# Altium schematic sheet Page05 LPDDR4.SchDoc
size 513 x 386 mm
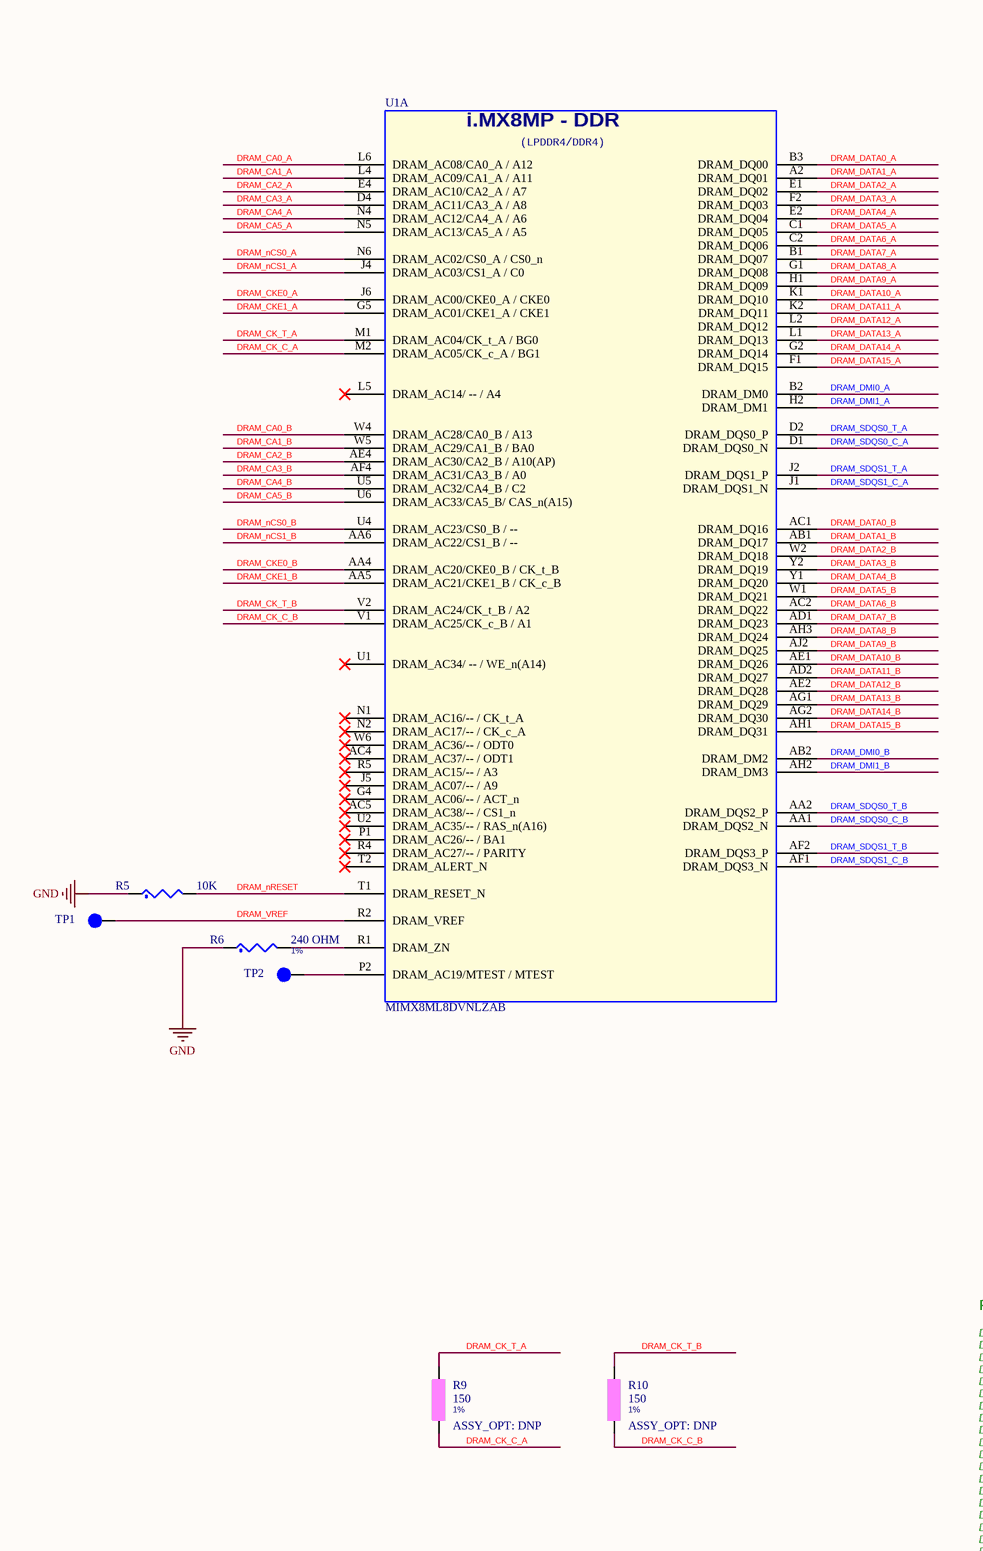
[diagram p0: Page05 LPDDR4.SchDoc, left]
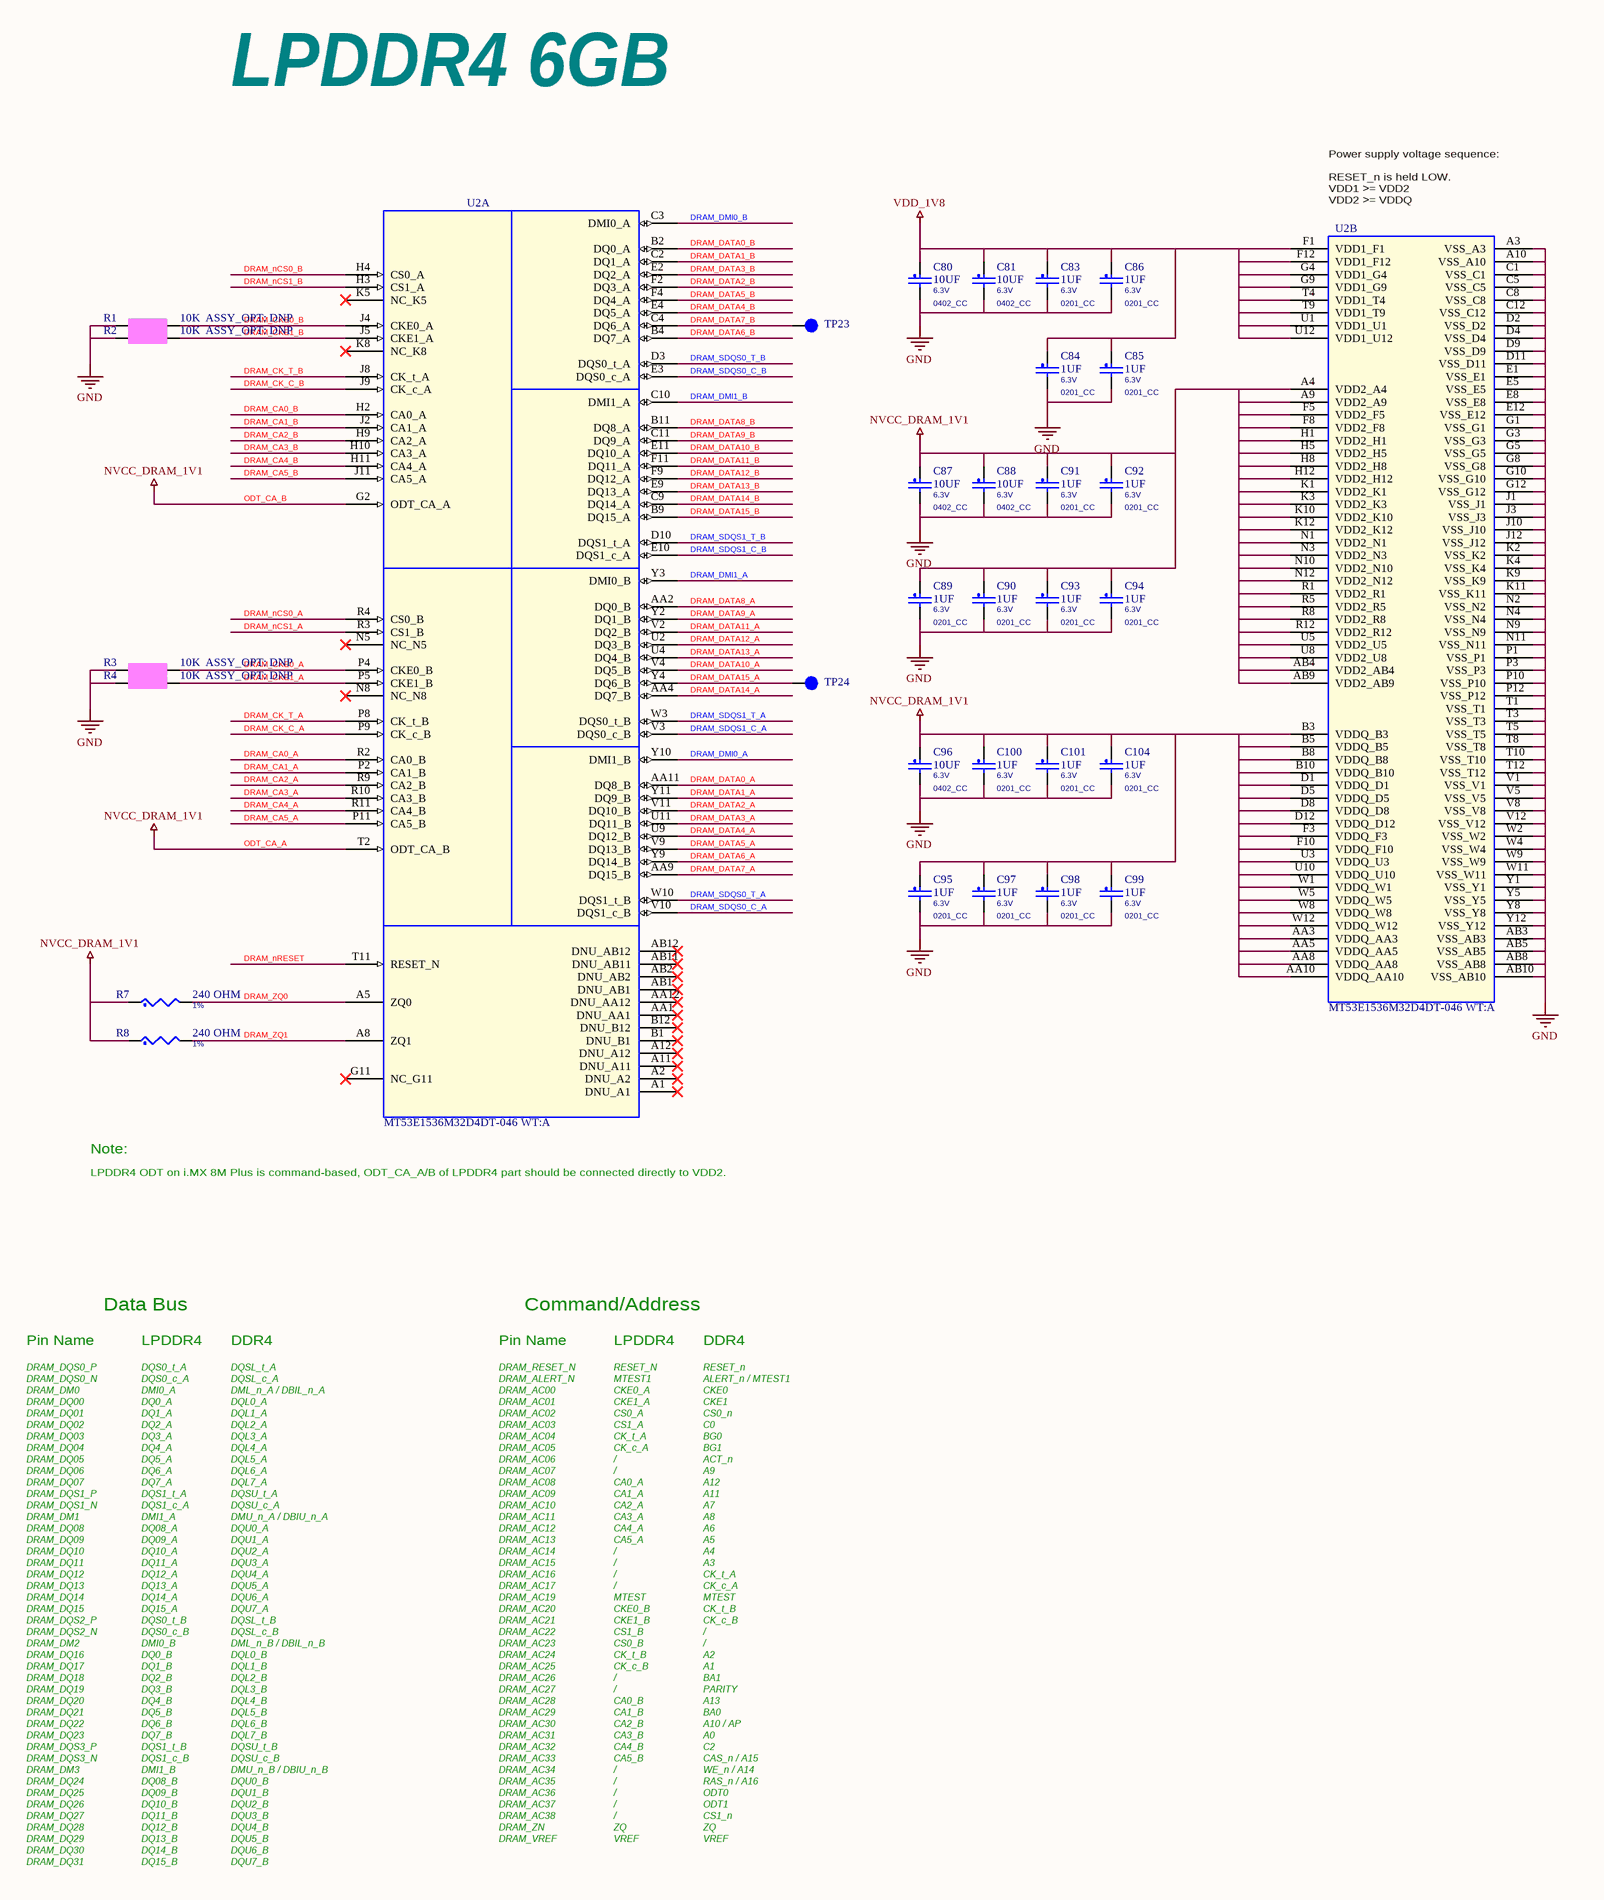
[diagram p1: Page05 LPDDR4.SchDoc, right]

## Parts
C80  10UF  VOLTAGE: 6.3V  [0402_CC]
C81  10UF  VOLTAGE: 6.3V  [0402_CC]
C83  1UF  VOLTAGE: 6.3V  [0201_CC]
C84  1UF  VOLTAGE: 6.3V  [0201_CC]
C85  1UF  VOLTAGE: 6.3V  [0201_CC]
C86  1UF  VOLTAGE: 6.3V  [0201_CC]
C87  10UF  VOLTAGE: 6.3V  [0402_CC]
C88  10UF  VOLTAGE: 6.3V  [0402_CC]
C89  1UF  VOLTAGE: 6.3V  [0201_CC]
C90  1UF  VOLTAGE: 6.3V  [0201_CC]
C91  1UF  VOLTAGE: 6.3V  [0201_CC]
C92  1UF  VOLTAGE: 6.3V  [0201_CC]
C93  1UF  VOLTAGE: 6.3V  [0201_CC]
C94  1UF  VOLTAGE: 6.3V  [0201_CC]
C95  1UF  VOLTAGE: 6.3V  [0201_CC]
C96  10UF  VOLTAGE: 6.3V  [0402_CC]
C97  1UF  VOLTAGE: 6.3V  [0201_CC]
C98  1UF  VOLTAGE: 6.3V  [0201_CC]
C99  1UF  VOLTAGE: 6.3V  [0201_CC]
C100  1UF  VOLTAGE: 6.3V  [0201_CC]
C101  1UF  VOLTAGE: 6.3V  [0201_CC]
C104  1UF  VOLTAGE: 6.3V  [0201_CC]
R1  10K  ASSY_OPT: DNP  [0402_CC]
R2  10K  ASSY_OPT: DNP  [0402_CC]
R3  10K  ASSY_OPT: DNP  [0402_CC]
R4  10K  ASSY_OPT: DNP  [0402_CC]
R5  10K  [0201_CC]
R6  240 OHM  Tolerance: 1%  [0201_CC]
R7  240 OHM  Tolerance: 1%  [0201_CC]
R8  240 OHM  Tolerance: 1%  [0201_CC]
R9  150  ASSY_OPT: DNP  Tolerance: 1%  [0402_CC]
R10  150  ASSY_OPT: DNP  Tolerance: 1%  [0402_CC]
TP1  TPAD_015  [TPAD_015]  (value not drawn)
TP2  TPAD_015  [TPAD_015]  (value not drawn)
TP23  tpad_020  [tpad_020]  (value not drawn)
TP24  tpad_020  [tpad_020]  (value not drawn)
U1  MIMX8ML8DVNLZAB  [BGA_M865S_0P5_15X15-BMS]  (part A of 15)
U2  MT53E1536M32D4DT-046 WT:A  [bga200_0p65x0p8_10p1x14p6]  (parts A,B of 2)

## Nets
GND: C80.2 C81.2 C83.2 C84.2 C85.2 C86.2 C87.2 C88.2 C89.2 C90.2 C91.2 C92.2 C93.2 C94.2 C95.2 C96.2 C97.2 C98.2 C99.2 C100.2 C101.2 C104.2 R1.1 R2.1 R3.1 R4.1 R5.1 R6.1 U2.A3(VSS_A3) U2.A10(VSS_A10) U2.AB3(VSS_AB3) U2.AB5(VSS_AB5) U2.AB8(VSS_AB8) U2.AB10(VSS_AB10) U2.C1(VSS_C1) U2.C5(VSS_C5) U2.C8(VSS_C8) U2.C12(VSS_C12) U2.D2(VSS_D2) U2.D4(VSS_D4) U2.D9(VSS_D9) U2.D11(VSS_D11) U2.E1(VSS_E1) U2.E5(VSS_E5) U2.E8(VSS_E8) U2.E12(VSS_E12) U2.G1(VSS_G1) U2.G3(VSS_G3) U2.G5(VSS_G5) U2.G8(VSS_G8) U2.G10(VSS_G10) U2.G12(VSS_G12) U2.J1(VSS_J1) U2.J3(VSS_J3) U2.J10(VSS_J10) U2.J12(VSS_J12) U2.K2(VSS_K2) U2.K4(VSS_K4) U2.K9(VSS_K9) U2.K11(VSS_K11) U2.N2(VSS_N2) U2.N4(VSS_N4) U2.N9(VSS_N9) U2.N11(VSS_N11) U2.P1(VSS_P1) U2.P3(VSS_P3) U2.P10(VSS_P10) U2.P12(VSS_P12) U2.T1(VSS_T1) U2.T3(VSS_T3) U2.T5(VSS_T5) U2.T8(VSS_T8) U2.T10(VSS_T10) U2.T12(VSS_T12) U2.V1(VSS_V1) U2.V5(VSS_V5) U2.V8(VSS_V8) U2.V12(VSS_V12) U2.W2(VSS_W2) U2.W4(VSS_W4) U2.W9(VSS_W9) U2.W11(VSS_W11) U2.Y1(VSS_Y1) U2.Y5(VSS_Y5) U2.Y8(VSS_Y8) U2.Y12(VSS_Y12)
ODT_CA_A: C87.1 C88.1 C89.1 C90.1 C91.1 C92.1 C93.1 C94.1 C95.1 C96.1 C97.1 C98.1 C99.1 C100.1 C101.1 C104.1 R7.1 R8.1 U2.A4(VDD2_A4) U2.A9(VDD2_A9) U2.AA3(VDDQ_AA3) U2.AA5(VDDQ_AA5) U2.AA8(VDDQ_AA8) U2.AA10(VDDQ_AA10) U2.AB4(VDD2_AB4) U2.AB9(VDD2_AB9) U2.B3(VDDQ_B3) U2.B5(VDDQ_B5) U2.B8(VDDQ_B8) U2.B10(VDDQ_B10) U2.D1(VDDQ_D1) U2.D5(VDDQ_D5) U2.D8(VDDQ_D8) U2.D12(VDDQ_D12) U2.F3(VDDQ_F3) U2.F5(VDD2_F5) U2.F8(VDD2_F8) U2.F10(VDDQ_F10) U2.G2(ODT_CA_A) U2.H1(VDD2_H1) U2.H5(VDD2_H5) U2.H8(VDD2_H8) U2.H12(VDD2_H12) U2.K1(VDD2_K1) U2.K3(VDD2_K3) U2.K10(VDD2_K10) U2.K12(VDD2_K12) U2.N1(VDD2_N1) U2.N3(VDD2_N3) U2.N10(VDD2_N10) U2.N12(VDD2_N12) U2.R1(VDD2_R1) U2.R5(VDD2_R5) U2.R8(VDD2_R8) U2.R12(VDD2_R12) U2.T2(ODT_CA_B) U2.U3(VDDQ_U3) U2.U5(VDD2_U5) U2.U8(VDD2_U8) U2.U10(VDDQ_U10) U2.W1(VDDQ_W1) U2.W5(VDDQ_W5) U2.W8(VDDQ_W8) U2.W12(VDDQ_W12)  [also labelled NVCC_DRAM_1V1, ODT_CA_B]
VDD_1V8: C80.1 C81.1 C83.1 C84.1 C85.1 C86.1 U2.F1(VDD1_F1) U2.F12(VDD1_F12) U2.G4(VDD1_G4) U2.G9(VDD1_G9) U2.T4(VDD1_T4) U2.T9(VDD1_T9) U2.U1(VDD1_U1) U2.U12(VDD1_U12)
DRAM_CA0_A: U1.L6(DRAM_AC08/CA0_A_/_A12) U2.R2(CA0_B)
DRAM_CA0_B: U1.W4(DRAM_AC28/CA0_B_/_A13) U2.H2(CA0_A)
DRAM_CA1_A: U1.L4(DRAM_AC09/CA1_A_/_A11) U2.P2(CA1_B)
DRAM_CA1_B: U1.W5(DRAM_AC29/CA1_B_/_BA0) U2.J2(CA1_A)
DRAM_CA2_A: U1.E4(DRAM_AC10/CA2_A_/_A7) U2.R9(CA2_B)
DRAM_CA2_B: U1.AE4(DRAM_AC30/CA2_B_/_A10(AP)) U2.H9(CA2_A)
DRAM_CA3_A: U1.D4(DRAM_AC11/CA3_A_/_A8) U2.R10(CA3_B)
DRAM_CA3_B: U1.AF4(DRAM_AC31/CA3_B_/_A0) U2.H10(CA3_A)
DRAM_CA4_A: U1.N4(DRAM_AC12/CA4_A_/_A6) U2.R11(CA4_B)
DRAM_CA4_B: U1.U5(DRAM_AC32/CA4_B_/_C2) U2.H11(CA4_A)
DRAM_CA5_A: U1.N5(DRAM_AC13/CA5_A_/_A5) U2.P11(CA5_B)
DRAM_CA5_B: U1.U6(DRAM_AC33/CA5_B/_CAS_n(A15)) U2.J11(CA5_A)
DRAM_CK_C_A: R9.2 U1.M2(DRAM_AC05/CK_c_A_/_BG1) U2.P9(CK_c_B)
DRAM_CK_C_B: R10.2 U1.V1(DRAM_AC25/CK_c_B_/_A1) U2.J9(CK_c_A)
DRAM_CK_T_A: R9.1 U1.M1(DRAM_AC04/CK_t_A_/_BG0) U2.P8(CK_t_B)
DRAM_CK_T_B: R10.1 U1.V2(DRAM_AC24/CK_t_B_/_A2) U2.J8(CK_t_A)
DRAM_CKE0_A: R3.2 U1.J6(DRAM_AC00/CKE0_A_/_CKE0) U2.P4(CKE0_B)
DRAM_CKE0_B: R1.2 U1.AA4(DRAM_AC20/CKE0_B_/_CK_t_B) U2.J4(CKE0_A)
DRAM_CKE1_A: R4.2 U1.G5(DRAM_AC01/CKE1_A_/_CKE1) U2.P5(CKE1_B)
DRAM_CKE1_B: R2.2 U1.AA5(DRAM_AC21/CKE1_B_/_CK_c_B) U2.J5(CKE1_A)
DRAM_DATA0_A: U1.B3(DRAM_DQ00) U2.AA11(DQ8_B)
DRAM_DATA0_B: U1.AC1(DRAM_DQ16) U2.B2(DQ0_A)
DRAM_DATA1_A: U1.A2(DRAM_DQ01) U2.Y11(DQ9_B)
DRAM_DATA1_B: U1.AB1(DRAM_DQ17) U2.C2(DQ1_A)
DRAM_DATA2_A: U1.E1(DRAM_DQ02) U2.V11(DQ10_B)
DRAM_DATA2_B: U1.W2(DRAM_DQ18) U2.F2(DQ3_A)
DRAM_DATA3_A: U1.F2(DRAM_DQ03) U2.U11(DQ11_B)
DRAM_DATA3_B: U1.Y2(DRAM_DQ19) U2.E2(DQ2_A)
DRAM_DATA4_A: U1.E2(DRAM_DQ04) U2.U9(DQ12_B)
DRAM_DATA4_B: U1.Y1(DRAM_DQ20) U2.E4(DQ5_A)
DRAM_DATA5_A: U1.C1(DRAM_DQ05) U2.V9(DQ13_B)
DRAM_DATA5_B: U1.W1(DRAM_DQ21) U2.F4(DQ4_A)
DRAM_DATA6_A: U1.C2(DRAM_DQ06) U2.Y9(DQ14_B)
DRAM_DATA6_B: U1.AC2(DRAM_DQ22) U2.B4(DQ7_A)
DRAM_DATA7_A: U1.B1(DRAM_DQ07) U2.AA9(DQ15_B)
DRAM_DATA7_B: TP23.1(Pin1) U1.AD1(DRAM_DQ23) U2.C4(DQ6_A)
DRAM_DATA8_A: U1.G1(DRAM_DQ08) U2.AA2(DQ0_B)
DRAM_DATA8_B: U1.AH3(DRAM_DQ24) U2.B11(DQ8_A)
DRAM_DATA9_A: U1.H1(DRAM_DQ09) U2.Y2(DQ1_B)
DRAM_DATA9_B: U1.AJ2(DRAM_DQ25) U2.C11(DQ9_A)
DRAM_DATA10_A: U1.K1(DRAM_DQ10) U2.V4(DQ5_B)
DRAM_DATA10_B: U1.AE1(DRAM_DQ26) U2.E11(DQ10_A)
DRAM_DATA11_A: U1.K2(DRAM_DQ11) U2.V2(DQ2_B)
DRAM_DATA11_B: U1.AD2(DRAM_DQ27) U2.F11(DQ11_A)
DRAM_DATA12_A: U1.L2(DRAM_DQ12) U2.U2(DQ3_B)
DRAM_DATA12_B: U1.AE2(DRAM_DQ28) U2.F9(DQ12_A)
DRAM_DATA13_A: U1.L1(DRAM_DQ13) U2.U4(DQ4_B)
DRAM_DATA13_B: U1.AG1(DRAM_DQ29) U2.E9(DQ13_A)
DRAM_DATA14_A: U1.G2(DRAM_DQ14) U2.AA4(DQ7_B)
DRAM_DATA14_B: U1.AG2(DRAM_DQ30) U2.C9(DQ14_A)
DRAM_DATA15_A: TP24.1(Pin1) U1.F1(DRAM_DQ15) U2.Y4(DQ6_B)
DRAM_DATA15_B: U1.AH1(DRAM_DQ31) U2.B9(DQ15_A)
DRAM_DMI0_A: U1.B2(DRAM_DM0) U2.Y10(DMI1_B)
DRAM_DMI0_B: U1.AB2(DRAM_DM2) U2.C3(DMI0_A)
DRAM_DMI1_A: U1.H2(DRAM_DM1) U2.Y3(DMI0_B)
DRAM_DMI1_B: U1.AH2(DRAM_DM3) U2.C10(DMI1_A)
DRAM_nCS0_A: U1.N6(DRAM_AC02/CS0_A_/_CS0_n) U2.R4(CS0_B)
DRAM_nCS0_B: U1.U4(DRAM_AC23/CS0_B_/_--) U2.H4(CS0_A)
DRAM_nCS1_A: U1.J4(DRAM_AC03/CS1_A_/_C0) U2.R3(CS1_B)
DRAM_nCS1_B: U1.AA6(DRAM_AC22/CS1_B_/_--) U2.H3(CS1_A)
DRAM_nRESET: R5.2 U1.T1(DRAM_RESET_N) U2.T11(RESET_N)
DRAM_SDQS0_C_A: U1.D1(DRAM_DQS0_N) U2.V10(DQS1_c_B)
DRAM_SDQS0_C_B: U1.AA1(DRAM_DQS2_N) U2.E3(DQS0_c_A)
DRAM_SDQS0_T_A: U1.D2(DRAM_DQS0_P) U2.W10(DQS1_t_B)
DRAM_SDQS0_T_B: U1.AA2(DRAM_DQS2_P) U2.D3(DQS0_t_A)
DRAM_SDQS1_C_A: U1.J1(DRAM_DQS1_N) U2.V3(DQS0_c_B)
DRAM_SDQS1_C_B: U1.AF1(DRAM_DQS3_N) U2.E10(DQS1_c_A)
DRAM_SDQS1_T_A: U1.J2(DRAM_DQS1_P) U2.W3(DQS0_t_B)
DRAM_SDQS1_T_B: U1.AF2(DRAM_DQS3_P) U2.D10(DQS1_t_A)
DRAM_VREF: TP1.1(Pin1) U1.R2(DRAM_VREF)
DRAM_ZQ0: R7.2 U2.A5(ZQ0)
DRAM_ZQ1: R8.2 U2.A8(ZQ1)
NetR6_2: R6.2 U1.R1(DRAM_ZN)
NetTP2_1: TP2.1(Pin1) U1.P2(DRAM_AC19/MTEST_/_MTEST)

Not connected (* = marked no-connect by the designer): U1 AC4(DRAM_AC37/--_/_ODT1)* AC5(DRAM_AC38/--_/_CS1_n)* G4(DRAM_AC06/--_/_ACT_n)* J5(DRAM_AC07/--_/_A9)* L5(DRAM_AC14/_--_/_A4)* N1(DRAM_AC16/--_/_CK_t_A)* N2(DRAM_AC17/--_/_CK_c_A)* P1(DRAM_AC26/--_/_BA1)* R4(DRAM_AC27/--_/_PARITY)* R5(DRAM_AC15/--_/_A3)* T2(DRAM_ALERT_N)* U1(DRAM_AC34/_--_/_WE_n(A14))* U2(DRAM_AC35/--_/_RAS_n(A16))* W6(DRAM_AC36/--_/_ODT0)*; U2 A1(DNU_A1)* A2(DNU_A2)* A11(DNU_A11)* A12(DNU_A12)* AA1(DNU_AA1)* AA12(DNU_AA12)* AB1(DNU_AB1)* AB2(DNU_AB2)* AB11(DNU_AB11)* AB12(DNU_AB12)* B1(DNU_B1)* B12(DNU_B12)* G11(NC_G11)* K5(NC_K5)* K8(NC_K8)* N5(NC_N5)* N8(NC_N8)*

## Notes on the sheet
- LPDDR4 6GB
- (near U2) Power supply voltage sequence:
  RESET_n is held LOW.
  VDD1 >= VDD2
  VDD2 >= VDDQ
- Note:
- LPDDR4 ODT on i.MX 8M Plus is command-based, ODT_CA_A/B of LPDDR4 part should be connected directly to VDD2.
- Pin Name
- DRAM_DQS0_P
  DRAM_DQS0_N
  DRAM_DM0
  DRAM_DQ00
  DRAM_DQ01
  DRAM_DQ02
  DRAM_DQ03
  DRAM_DQ04
  DRAM_DQ05
  DRAM_DQ06
  DRAM_DQ07
  DRAM_DQS1_P
  DRAM_DQS1_N
  DRAM_DM1
  DRAM_DQ08
  DRAM_DQ09
  DRAM_DQ10
  DRAM_DQ11
  DRAM_DQ12
  DRAM_DQ13
  DRAM_DQ14
  DRAM_DQ15
  DRAM_DQS2_P
  DRAM_DQS2_N
  DRAM_DM2
  DRAM_DQ16
  DRAM_DQ17
  DRAM_DQ18
  DRAM_DQ19
  DRAM_DQ20
  DRAM_DQ21
  DRAM_DQ22
  DRAM_DQ23
  DRAM_DQS3_P
  DRAM_DQS3_N
  DRAM_DM3
  DRAM_DQ24
  DRAM_DQ25
  DRAM_DQ26
  DRAM_DQ27
  DRAM_DQ28
  DRAM_DQ29
  DRAM_DQ30
  DRAM_DQ31
- Data Bus
- DQS0_t_A
  DQS0_c_A
  DMI0_A
  DQ0_A
  DQ1_A
  DQ2_A
  DQ3_A
  DQ4_A
  DQ5_A
  DQ6_A
  DQ7_A
  DQS1_t_A
  DQS1_c_A
  DMI1_A
  DQ08_A
  DQ09_A
  DQ10_A
  DQ11_A
  DQ12_A
  DQ13_A
  DQ14_A
  DQ15_A
  DQS0_t_B
  DQS0_c_B
  DMI0_B
  DQ0_B
  DQ1_B
  DQ2_B
  DQ3_B
  DQ4_B
  DQ5_B
  DQ6_B
  DQ7_B
  DQS1_t_B
  DQS1_c_B
  DMI1_B
  DQ08_B
  DQ09_B
  DQ10_B
  DQ11_B
  DQ12_B
  DQ13_B
  DQ14_B
  DQ15_B
- LPDDR4
- DQSL_t_A
  DQSL_c_A
  DML_n_A / DBIL_n_A
  DQL0_A
  DQL1_A
  DQL2_A
  DQL3_A
  DQL4_A
  DQL5_A
  DQL6_A
  DQL7_A
  DQSU_t_A
  DQSU_c_A
  DMU_n_A / DBIU_n_A
  DQU0_A
  DQU1_A
  DQU2_A
  DQU3_A
  DQU4_A
  DQU5_A
  DQU6_A
  DQU7_A
  DQSL_t_B
  DQSL_c_B
  DML_n_B / DBIL_n_B
  DQL0_B
  DQL1_B
  DQL2_B
  DQL3_B
  DQL4_B
  DQL5_B
  DQL6_B
  DQL7_B
  DQSU_t_B
  DQSU_c_B
  DMU_n_B / DBIU_n_B
  DQU0_B
  DQU1_B
  DQU2_B
  DQU3_B
  DQU4_B
  DQU5_B
  DQU6_B
  DQU7_B
- DDR4
- DRAM_RESET_N
  DRAM_ALERT_N
  DRAM_AC00
  DRAM_AC01
  DRAM_AC02
  DRAM_AC03
  DRAM_AC04
  DRAM_AC05
  DRAM_AC06
  DRAM_AC07
  DRAM_AC08
  DRAM_AC09
  DRAM_AC10
  DRAM_AC11
  DRAM_AC12
  DRAM_AC13
  DRAM_AC14
  DRAM_AC15
  DRAM_AC16
  DRAM_AC17
  DRAM_AC19
  DRAM_AC20
  DRAM_AC21
  DRAM_AC22
  DRAM_AC23
  DRAM_AC24
  DRAM_AC25
  DRAM_AC26
  DRAM_AC27
  DRAM_AC28
  DRAM_AC29
  DRAM_AC30
  DRAM_AC31
  DRAM_AC32
  DRAM_AC33
  DRAM_AC34
  DRAM_AC35
  DRAM_AC36
  DRAM_AC37
  DRAM_AC38
  DRAM_ZN
  DRAM_VREF
- Command/Address
- RESET_N
  MTEST1
  CKE0_A
  CKE1_A
  CS0_A
  CS1_A
  CK_t_A
  CK_c_A
  /
  /
  CA0_A
  CA1_A
  CA2_A
  CA3_A
  CA4_A
  CA5_A
  /
  /
  /
  /
  MTEST
  CKE0_B
  CKE1_B
  CS1_B
  CS0_B
  CK_t_B
  CK_c_B
  /
  /
  CA0_B
  CA1_B
  CA2_B
  CA3_B
  CA4_B
  CA5_B
  /
  /
  /
  /
  /
  ZQ
  VREF
- RESET_n
  ALERT_n / MTEST1
  CKE0
  CKE1
  CS0_n
  C0
  BG0
  BG1
  ACT_n
  A9
  A12
  A11
  A7
  A8
  A6
  A5
  A4
  A3
  CK_t_A
  CK_c_A
  MTEST
  CK_t_B
  CK_c_B
  /
  /
  A2
  A1
  BA1
  PARITY
  A13
  BA0
  A10 / AP
  A0
  C2
  CAS_n / A15
  WE_n / A14
  RAS_n / A16
  ODT0
  ODT1
  CS1_n
  ZQ
  VREF
- (in symbol MIMX8MP_BGA548, part A) i.MX8MP - DDR; (LPDDR4/DDR4)

## Library data of the parts
C80 C81 C96 = CAP_NP: CAP CER 10UF 6.3V 20% X5R 0402; CLASS: DISCRETE; FPLIST: CC0402_25,CC0402_HD,0402_CC; CAD_APPROVED: Yes; MFG_PN01: CL05A106MQ5NUNC; MFG_NAME01: SAMSUNG ELECTRO MECHANICS; AGILE_PN: 150-79163; HEIGHT: 0.65 MM; ROHS: Yes; Tolerance: 20%; PCB Footprint: 0402_CC
C83 C85 C91 C92 C94 C97 C99 C100 C104 = CAP_NP: CAP CER 1uF 6.3V 20% X5R 0201; CLASS: DISCRETE; AGILE_PN: 150-79407; MFG_NAME01: AVX; MFG_PN01: 02016D105MAT2A; CAD_APPROVED: Yes; FPLIST: CC0201,CC0201_HD,0201_CC,0201_CC_012SM_NSP; Tolerance: 20%; ROHS: Yes; HEIGHT: 0.35MM; PCB Footprint: 0201_CC; Package Size: 0201; Package Type: 7¡± reel
C84 C86 C89 C90 C93 C95 C98 C101 = CAP_NP: CAP CER 1uF 6.3V 20% X5R 0201; CLASS: DISCRETE; FPLIST: CC0201,CC0201_HD,0201_CC,0201_CC_012SM_NSP; CAD_APPROVED: Yes; MFG_PN01: 02016D105MAT2A; MFG_NAME01: AVX; AGILE_PN: 150-79407; HEIGHT: 0.35MM; ROHS: Yes; Tolerance: 20%; PCB Footprint: 0201_CC; Package Size: 0201; Package Type: 7¡± reel
C87 C88 = CAP_NP: CAP CER 10UF 6.3V 20% X5R 0402; CLASS: DISCRETE; AGILE_PN: 150-79163; MFG_NAME01: SAMSUNG ELECTRO MECHANICS; MFG_PN01: CL05A106MQ5NUNC; CAD_APPROVED: Yes; FPLIST: CC0402_25,CC0402_HD,0402_CC; Tolerance: 20%; ROHS: Yes; HEIGHT: 0.65 MM; PCB Footprint: 0402_CC
R1 R2 = RES: RES MF 10K 1/16W 5% 0402; CLASS: DISCRETE; AGILE_PN: 470-75557; MFG_NAME01: VISHAY INTERTECHNOLOGY; MFG_PN01: CRCW040210K0JNED; CAD_APPROVED: Yes; FPLIST: RC0402_25,RC0402_HD,0402_CC; PCB Footprint: 0402_CC; HEIGHT: 0.4 MM; Tolerance: 5%; ROHS: Yes
R3 R4 = RES: RES MF 10K 1/16W 5% 0402; CLASS: DISCRETE; FPLIST: RC0402_25,RC0402_HD,0402_CC; CAD_APPROVED: Yes; MFG_PN01: CRCW040210K0JNED; MFG_NAME01: VISHAY INTERTECHNOLOGY; AGILE_PN: 470-75557; PCB Footprint: 0402_CC; ROHS: Yes; Tolerance: 5%; HEIGHT: 0.4 MM
R5 = RES: RES MF 10K 1/20W 5% 0201; CLASS: DISCRETE; FPLIST: RC0201,0201_CC; CAD_APPROVED: Yes; MFG_PN01: RTT01103JTH; MFG_NAME01: RALEC ELECTRONIC CORP; AGILE_PN: 470-79719; HEIGHT: 0.26 MM; ROHS: Yes; Tolerance: 5%; PCB Footprint: 0201_CC
R6 = RES: RES MF 240 OHM 1/20W 1% 0201; CLASS: DISCRETE; Temp Range: -55¡ãC ~ 125¡ãC; VOLTAGE: 25V; FPLIST: CC0201,CC0201_HD,0201_CC; CAD_APPROVED: Yes; MFG_PN01: RC0201FR-07240RL; MFG_NAME01: YAGEO AMERICA; AGILE_PN: 470-81317; HEIGHT: 0.26MM; Temp_Range: -55¡ãC ~ 125¡ãC; ROHS: Yes; PCB Footprint: 0201_CC
R7 = RES: RES MF 240 OHM 1/20W 1% 0201; CLASS: DISCRETE; AGILE_PN: 470-81317; MFG_NAME01: YAGEO AMERICA; MFG_PN01: RC0201FR-07240RL; Temp_Range: -55¡ãC ~ 125¡ãC; CAD_APPROVED: Yes; FPLIST: CC0201,CC0201_HD,0201_CC; VOLTAGE: 25V; PCB Footprint: 0201_CC; ROHS: Yes; HEIGHT: 0.26MM; Temp Range: -55¡ãC ~ 125¡ãC
R8 = RES: RES MF 240 OHM 1/20W 1% 0201; CLASS: DISCRETE; FPLIST: CC0201,CC0201_HD,0201_CC; CAD_APPROVED: Yes; Temp_Range: -55¡ãC ~ 125¡ãC; MFG_PN01: RC0201FR-07240RL; MFG_NAME01: YAGEO AMERICA; AGILE_PN: 470-81317; VOLTAGE: 25V; PCB Footprint: 0201_CC; HEIGHT: 0.26MM; ROHS: Yes; Temp Range: -55¡ãC ~ 125¡ãC
R9 R10 = RES: RES MF 150 OHM 1/16W 1% 0402; CLASS: DISCRETE; FPLIST: RC0402_25,RC0402_HD,0402_CC; CAD_APPROVED: Yes; MFG_PN01: NRCL04F1500TRF; MFG_NAME01: NIC COMPONENTS CORP; AGILE_PN: 470-75353; HEIGHT: 0.4MM; ROHS: Yes; PCB Footprint: 0402_CC
TP1 TP2 = TESTLOOP: TEST POINT PAD 15MIL DIA SMT, NO PART TO ORDER; ASSY_OPT: DNP; CLASS: IO; MFG_PN01: NOTACOMPONENT; CAD_APPROVED: Yes; AGILE_PN: 211-76645; PCB Footprint: TPAD_015; MFG_NAME01: NOTACOMPONENT; ROHS: Yes; HEIGHT: 0.1MM
TP23 = TESTLOOP: TEST POINT PAD 0.5MM DIA SMT, NO PART TO ORDER; ASSY_OPT: DNP; CLASS: IO; CAD_APPROVED: Yes; AGILE_PN: 211-77484; HEIGHT: 0.1MM; ROHS: Yes; PCB Footprint: tpad_020
TP24 = TESTLOOP: TEST POINT PAD 0.5MM DIA SMT, NO PART TO ORDER; ASSY_OPT: DNP; CLASS: IO; AGILE_PN: 211-77484; CAD_APPROVED: Yes; ROHS: Yes; HEIGHT: 0.1MM; PCB Footprint: tpad_020
U1 = MIMX8MP_BGA548: IC CPU QUAD CORTEX A53+M4 1.8GHZ BGA548; SPLIT_INST: TRUE; CAD_APPROVED: Yes; MFG_NAME01: NXP SEMICONDUCTORS; AGILE_PN: 330-77126; PCB Footprint: bga548_0p5_15x15mm; CLASS: IC; HEIGHT: 2.1MM; MFG_PN01: MIMX8ML8DVNLZAB
U2 = MT53B768M32D4NQ_200P: IC MEM LPDDR4 LPDDR4X SDRAM 1536 Meg x 32 1.1V VFBGA200; SWAP_INFO: (S1+S2); SPLIT_INST: TRUE; AGILE_PN: TMP-WF-36000; MFG_NAME01: MICRON; Temp_Range: ¨C25¡ãC to +85¡ãC; PRE_APN: 334-77850; CAD_APPROVED: Yes; CLASS: IC; PCB Footprint: bga200_0p65x0p8_10p1x14p6; MFG_PN01: MT53E1536M32D4DT-046 WT:A; ROHS: Yes; HEIGHT: 0.95MM; VOLTAGE: 1.1V; Temp Range: ¨C25¡ãC to +85¡ãC